# EAGLE design obdNode (EAGLE 6.5.0)
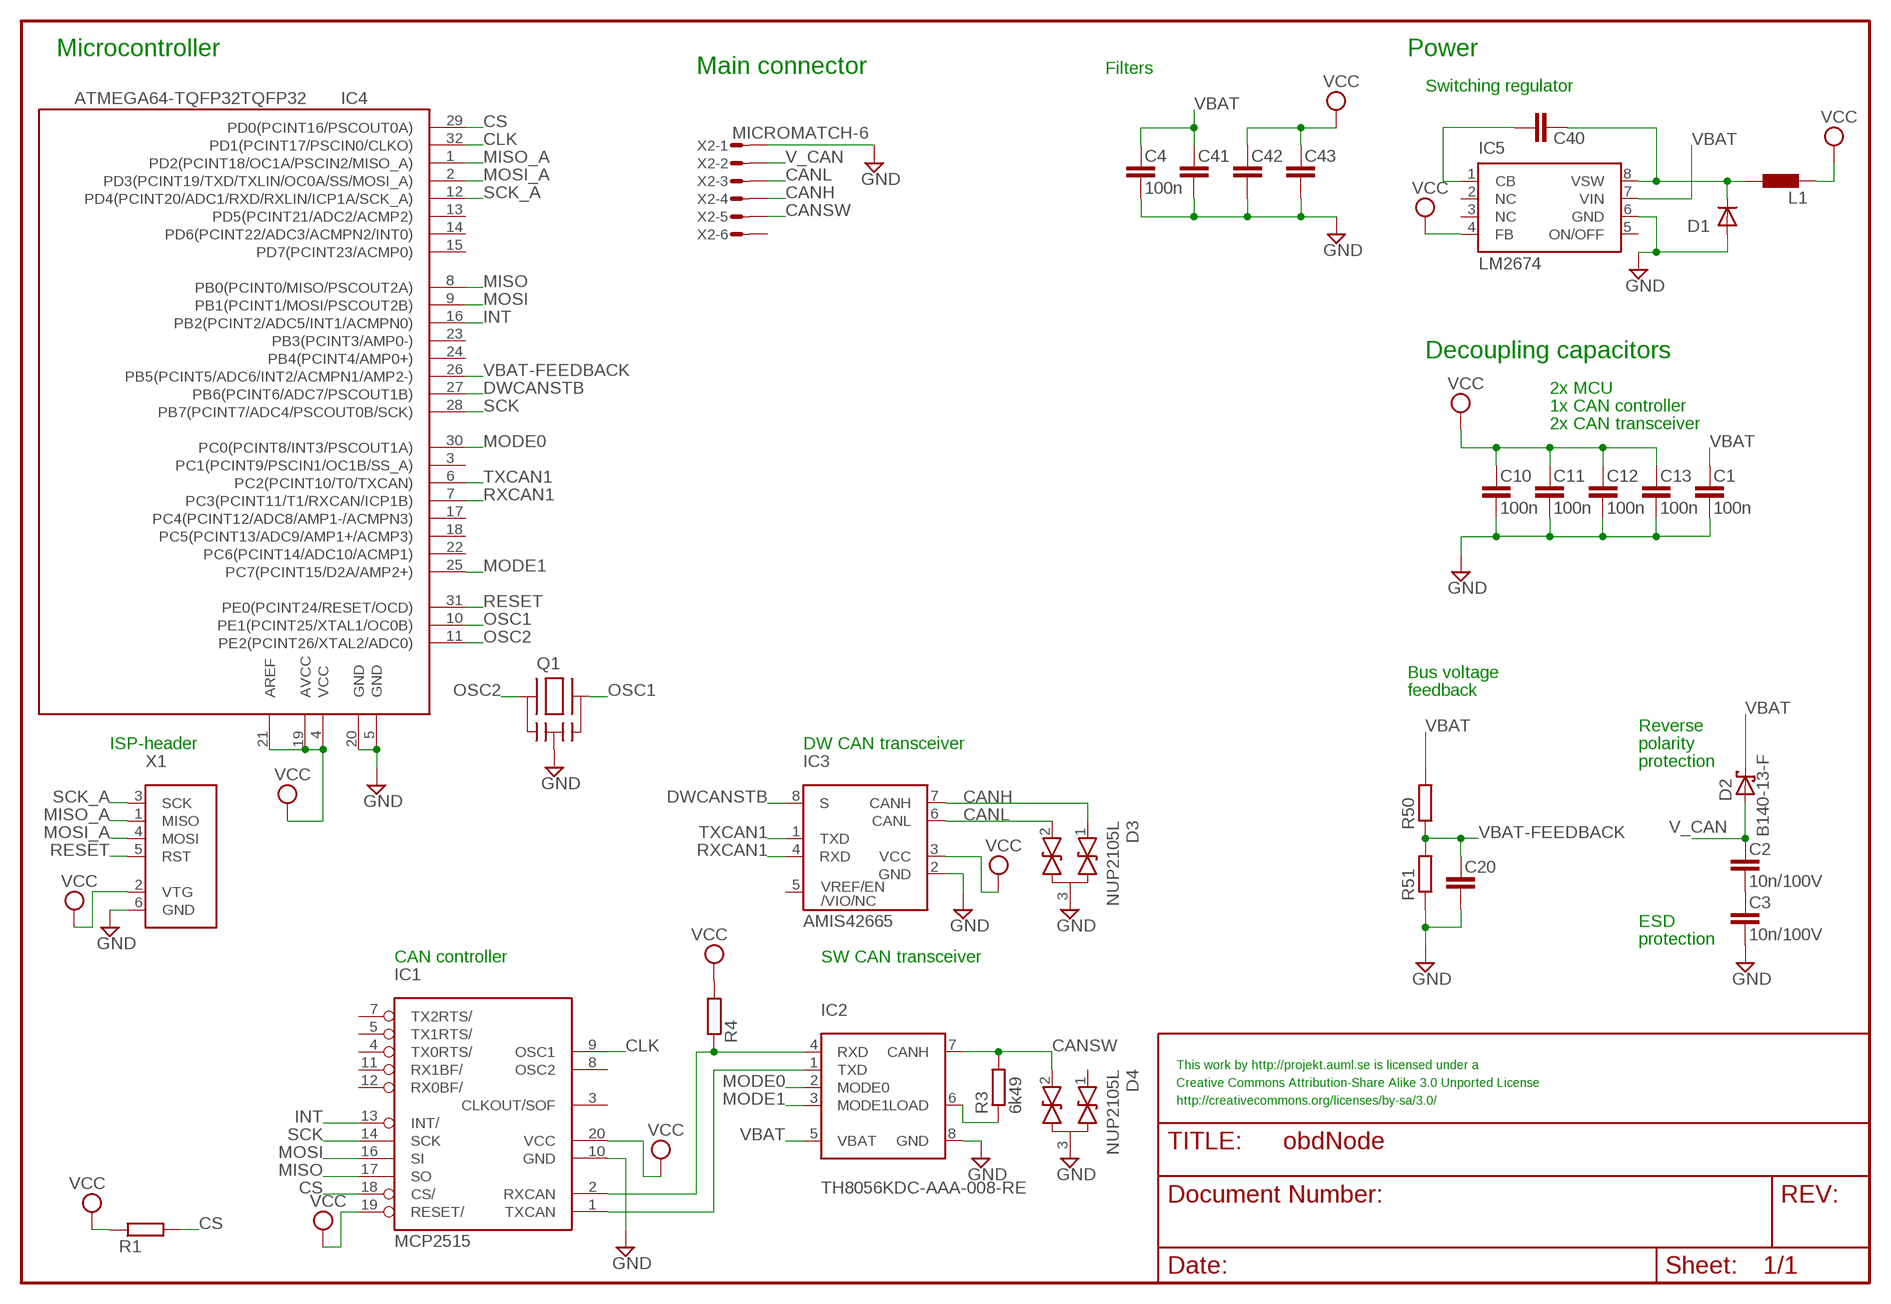
[diagram p0: schematic, sheet 1]

## Parts
C1  100n  C-EUC0402  [C0402]
C2  10n/100V  C-EUC0805  [C0805]
C3  10n/100V  C-EUC0805  [C0805]
C4  100n  C-EUC0402  [C0402]
C10  100n  C-EUC0402  [C0402]
C11  100n  C-EUC0402  [C0402]
C12  100n  C-EUC0402  [C0402]
C13  100n  C-EUC0402  [C0402]
C20  C-EUC0402  [C0402]
C40  C-EUC0603  [C0603]
C41  C-EUC1210  [C1210]
C42  C-EUC1210  [C1210]
C43  C-EUC0402  [C0402]
D1  DIODESMP  [DO-220AA]
D2  B140-13-F  SCHOTTKY-DIODESMA  [SMA]
D3  NUP2105L  DUALTVSSOT23  [SOT23]
D4  NUP2105L  DUALTVSSOT23  [SOT23]
IC1  MCP2515  [TSSOP]
IC2  TH8056KDC-AAA-008-RE  TH8056SOIC  [SOIC]
IC3  AMIS42665  [SOIC]
IC4  ATMEGA64-TQFP32TQFP32  [TQFP32]
IC5  LM2674  [SO8]
L1  L-EUL1210  [L1210]
Q1  CSTCESMD  [SMD]
R1  R-EUR0402  [R0402]
R3  6k49  R-EUR0805  [R0805]
R4  R-EUR0402  [R0402]
R50  R-EUR0402  [R0402]
R51  R-EUR0402  [R0402]
X1  AVRISP6PINHEADER  [6PINHEADER]
X2  MICROMATCH-6  [MICROMATCH-6]

## Nets
CANH: D3.1 IC3.7(CANH) X2.4
CANL: D3.2 IC3.6(CANL) X2.3
CANSW: D4.2 IC2.7(CANH) R3.2 X2.5
CB: C40.1 IC5.1(CB)
CLK: IC1.9(OSC1) IC4.32(PD1(PCINT17/PSCIN0/CLKO))
CS: IC1.18(CS/) IC4.29(PD0(PCINT16/PSCOUT0A)) R1.2
DWCANSTB: IC3.8(S) IC4.27(PB6(PCINT6/ADC7/PSCOUT1B))
GND: C1.2 C3.2 C4.2 C10.2 C11.2 C12.2 C13.2 C20.2 C41.2 C42.2 C43.2 D1.A D3.3 D4.3 IC1.10(GND) IC2.8(GND) IC3.2(GND) IC4.5(GND) IC4.20(GND) IC5.6(GND) Q1.2(GND) R51.1 X1.6(GND) X2.1
INT: IC1.13(INT/) IC4.16(PB2(PCINT2/ADC5/INT1/ACMPN0))
MISO: IC1.17(SO) IC4.8(PB0(PCINT0/MISO/PSCOUT2A))
MISO_A: IC4.1(PD2(PCINT18/OC1A/PSCIN2/MISO_A)) X1.1(MISO)
MODE0: IC2.2(MODE0) IC4.30(PC0(PCINT8/INT3/PSCOUT1A))
MODE1: IC2.3(MODE1) IC4.25(PC7(PCINT15/D2A/AMP2+))
MOSI: IC1.16(SI) IC4.9(PB1(PCINT1/MOSI/PSCOUT2B))
MOSI_A: IC4.2(PD3(PCINT19/TXD/TXLIN/OC0A/SS/MOSI_A)) X1.4(MOSI)
N$1: C2.2 C3.1
N$3: IC2.6(LOAD) R3.1
OSC1: IC4.10(PE1(PCINT25/XTAL1/OC0B)) Q1.3
OSC2: IC4.11(PE2(PCINT26/XTAL2/ADC0)) Q1.1
RESET: IC4.31(PE0(PCINT24/RESET/OCD)) X1.5(RST)
RXCAN1: IC3.4(RXD) IC4.7(PC3(PCINT11/T1/RXCAN/ICP1B))
RXCAN2: IC1.2(RXCAN) IC2.4(RXD) R4.1
SCK: IC1.14(SCK) IC4.28(PB7(PCINT7/ADC4/PSCOUT0B/SCK))
SCK_A: IC4.12(PD4(PCINT20/ADC1/RXD/RXLIN/ICP1A/SCK_A)) X1.3(SCK)
TXCAN1: IC3.1(TXD) IC4.6(PC2(PCINT10/T0/TXCAN))
TXCAN2: IC1.1(TXCAN) IC2.1(TXD)
V_CAN: C2.1 D2.A X2.2
VBAT: C1.1 C4.1 C41.1 D2.C IC2.5(VBAT) IC5.7(VIN) R50.2
VBAT-FEEDBACK: C20.1 IC4.26(PB5(PCINT5/ADC6/INT2/ACMPN1/AMP2-)) R50.1 R51.2
VCC: C10.1 C11.1 C12.1 C13.1 C42.1 C43.1 IC1.19(RESET/) IC1.20(VCC) IC3.3(VCC) IC4.4(VCC) IC4.19(AVCC) IC4.21(AREF) IC5.4(FB) L1.1 R1.1 R4.2 X1.2(VTG)
VSW: C40.2 D1.C IC5.8(VSW) L1.2
Unconnected: D4.1 IC1.3(CLKOUT/SOF) IC1.4(TX0RTS/) IC1.5(TX1RTS/) IC1.7(TX2RTS/) IC1.8(OSC2) IC1.11(RX1BF/) IC1.12(RX0BF/) IC3.5(VREF/EN/VIO/NC) IC4.3(PC1(PCINT9/PSCIN1/OC1B/SS_A)) IC4.13(PD5(PCINT21/ADC2/ACMP2)) IC4.14(PD6(PCINT22/ADC3/ACMPN2/INT0)) IC4.15(PD7(PCINT23/ACMP0)) IC4.17(PC4(PCINT12/ADC8/AMP1-/ACMPN3)) IC4.18(PC5(PCINT13/ADC9/AMP1+/ACMP3)) IC4.22(PC6(PCINT14/ADC10/ACMP1)) IC4.23(PB3(PCINT3/AMP0-)) IC4.24(PB4(PCINT4/AMP0+)) IC5.2(NC) IC5.3(NC) IC5.5(ON/OFF) X2.6

## Notes on the sheet
- Microcontroller | Power
- Main connector | Filters
- Switching regulator
- Decoupling capacitors
- 2x MCU
- 1x CAN controller
- 2x CAN transceiver
- Bus voltage
- feedback
- Reverse
- ISP-header | DW CAN transceiver | polarity
- protection
- ESD
- protection
- CAN controller | SW CAN transceiver
- This work by http://projekt.auml.se is licensed under a
- Creative Commons Attribution-Share Alike 3.0 Unported License
- http://creativecommons.org/licenses/by-sa/3.0/

## Library data of the parts
C1-C4 C10-C13 C20 C40-C43 = rcl:C-EU
D1 = diode:DIODE: DIODE ultra fast rectifier, 3 A
D2 = diode:SCHOTTKY-DIODE
D3 D4 = diode:DUALTVS
IC1 = mcp2515:MCP2515
IC2 = th8056:TH8056
IC3 = amis42665:AMIS42665
IC4 = atmega64:ATMEGA64-TQFP32
IC5 = lm2674:LM2674
L1 = rcl:L-EU
Q1 = xtal_CSTCE:CSTCE
R1 R3 R4 R50 R51 = rcl:R-EU
X1 = avrisp:AVRISP6PIN
X2 = con-amp-micromatch:MICROMATCH-6: MicroMaTch 6 7-215464-6 / 0-215464-6 Drawing Number C-215464 DDEController.pdf

## Board
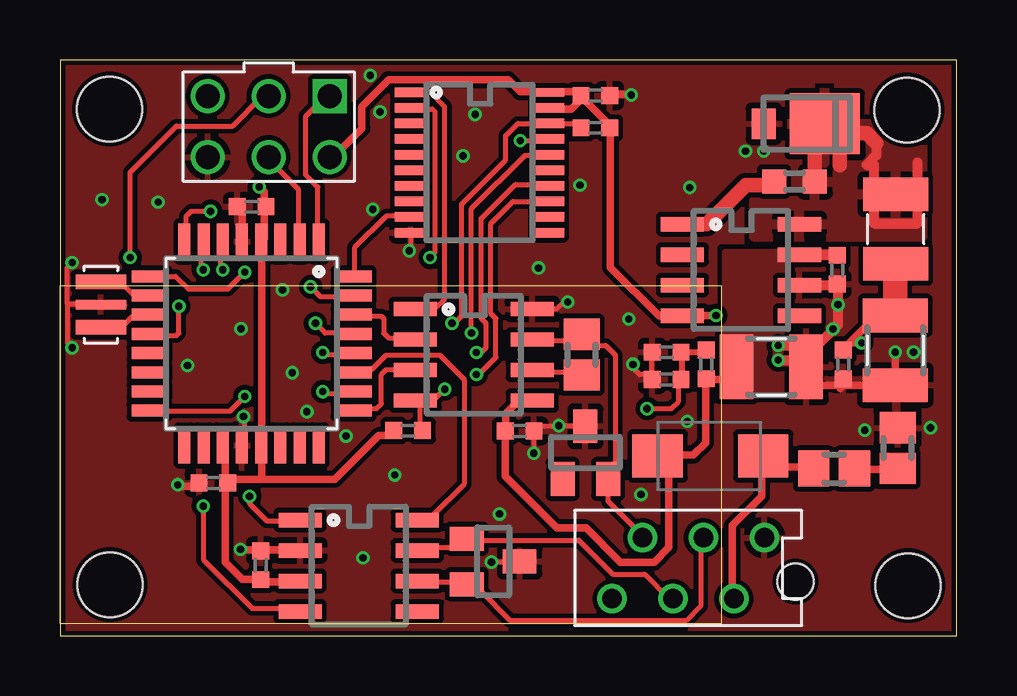
[diagram p1: board, top side]
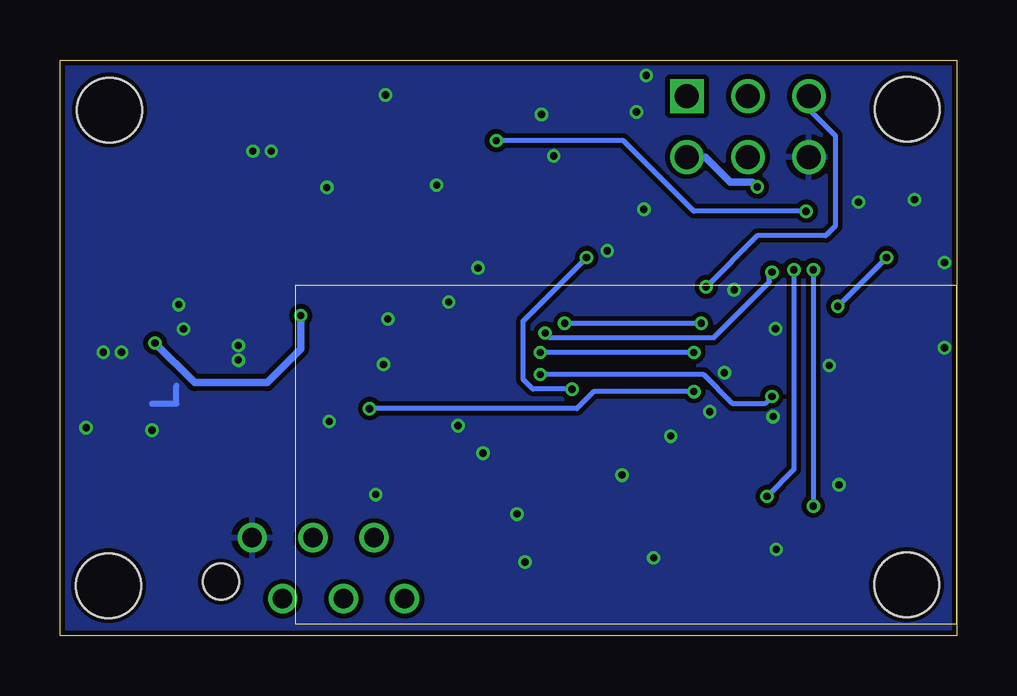
[diagram p2: board, bottom side, seen from below]

Size 37.36 x 24.01 mm. Coordinates in mm from the lower left corner, seen from the top.
Outline: 0,0 37.36,0 37.36,24.01 0,24.01 0,0
Copper layers (1*16): Top 0.035mm / dielectric 1.5mm / Bottom 0.035mm
Design rules "10mils, 0.6drill *": minimum track width 6mil, minimum drill 0.3mm, track to track 6mil, track to pad 6mil, pad to pad 6mil, via to via 6mil, smd to smd 0mil, copper to edge 8mil, drill to drill 10mil, minimum pad ring 8mil, minimum via ring 5mil, stop-mask expansion 0mil, vias tented up to drill 0.7mm, thermal gap 10mil
Holes 2.7 mm at 35.3,21.92 2.06,21.96 35.34,2.09 2.08,2.13
Milling: 4 lines

### Footprints (pad centres in the part's own frame; a part is rotated, then mirrored left to right if it is on the bottom)
C0402 = smd 0.7 x 0.7: 1 -0.6,0; 2 0.6,0
C0805 = smd 1.3 x 1.5: 1 -0.85,0; 2 0.85,0
C0603 = smd 1 x 1: 1 -0.85,0; 2 0.85,0
C1210 = smd 1.4 x 2.7: 1 -1.4,0; 2 1.5,0
DO-220AA = smd 1.016 x 1.27: A 1.143,0 | smd 2.921 x 2.54: C -1.397,0
SMA = smd 2.1 x 1.8: A 2.1,0; C -2.3,0
SOT23 = smd 1 x 1.4: 1 -0.95,-1.1; 2 0.95,-1.1; 3 0,1.1
TSSOP = smd 0.396 x 1.3: 1 -2.925,-2.875; 2 -2.275,-2.875; 3 -1.625,-2.875; 4 -0.975,-2.875; 5 -0.325,-2.875; 6 0.325,-2.875; 7 0.975,-2.875; 8 1.625,-2.875; 9 2.275,-2.875; 10 2.925,-2.875; 11 2.925,2.875; 12 2.275,2.875; 13 1.625,2.875; 14 0.975,2.875; 15 0.325,2.875; 16 -0.325,2.875; 17 -0.975,2.875; 18 -1.625,2.875; 19 -2.275,2.875 | smd 0.369 x 1.3: 20 -2.925,2.875
SOIC = smd 0.6 x 1.8: 1 -1.905,-2.44; 2 -0.635,-2.44; 3 0.635,-2.44; 4 1.905,-2.44; 5 1.905,2.44; 6 0.635,2.44; 7 -0.635,2.44; 8 -1.905,2.44
TQFP32 = smd 1.5 x 0.5: 1 -4.25,2.65; 2 -4.25,1.85; 3 -4.25,1.05; 4 -4.25,0.25; 5 -4.25,-0.55; 6 -4.25,-1.35; 7 -4.25,-2.15; 8 -4.25,-2.95; 17 4.25,-2.95; 18 4.25,-2.15; 19 4.25,-1.35; 20 4.25,-0.55; 21 4.25,0.25; 22 4.25,1.05; 23 4.25,1.85; 24 4.25,2.65 | smd 0.5 x 1.5: 9 -2.8,-4.4; 10 -2,-4.4; 11 -1.2,-4.4; 12 -0.4,-4.4; 13 0.4,-4.4; 14 1.2,-4.4; 15 2,-4.4; 16 2.8,-4.4; 25 2.8,4.1; 26 2,4.1; 27 1.2,4.1; 28 0.4,4.1; 29 -0.4,4.1; 30 -1.2,4.1; 31 -2,4.1; 32 -2.8,4.1
SO8 = smd 0.6 x 1.8: 1 -1.905,-2.44; 2 -0.635,-2.44; 3 0.635,-2.44; 4 1.905,-2.44; 5 1.905,2.44; 6 0.635,2.44; 7 -0.635,2.44; 8 -1.905,2.44
L1210 = smd 1.4 x 2.7: 1 -1.4,0; 2 1.5,0
SMD = smd 0.6 x 2.1: 1 -0.27,0.1; 3 1.63,0.1 | smd 0.4 x 2.1: 2 0.68,0.1
R0402 = smd 0.7 x 0.7: 1 -0.6,0; 2 0.6,0
R0805 = smd 1.3 x 1.5: 1 -0.85,0; 2 0.85,0
6PINHEADER = drill 1 square: 1 -1.27,2.54 | drill 1: 2 1.27,2.54; 3 -1.27,0; 4 1.27,0; 5 -1.27,-2.54; 6 1.27,-2.54
MICROMATCH-6 = drill 0.813: 1 3.175,1.27; 2 1.905,-1.27; 3 0.635,1.27; 4 -0.635,-1.27; 5 -1.905,1.27; 6 -3.175,-1.27 | hole 1.5: 4.469,-0.562

### Placement (x,y rotation side)
C1  19.15,8.55 0 top
C2  32.26,6.97 0 top
C3  34.9,7.83 90 top
C4  32.38,15.27 270 top
C10  6.39,6.37 180 top
C11  8.36,2.95 90 top
C12  22.31,22.53 0 top
C13  7.99,17.89 180 top
C20  25.27,11.83 180 top
C40  30.61,18.94 0 top
C41  29.59,11.22 0 top
C42  34.8,11.96 270 top
C43  32.64,11.32 270 top
D1  30.47,21.35 180 top
D2  27.2,7.5 0 top
D3  18.05,3.1 270 top
D4  21.89,7.64 0 top
IC1  17.48,19.74 270 top
IC2  17.24,11.72 270 top
IC3  12.45,2.92 270 top
IC4  8.13,12.19 270 top
IC5  28.37,15.26 270 top
L1  34.82,16.91 90 top
Q1  1.8,13.13 90 top
R1  22.31,21.18 180 top
R3  21.74,11.72 90 top
R4  14.5,8.56 180 top
R50  26.92,11.32 270 top
R51  25.27,10.69 0 top
X1  8.7,21.24 270 top
X2  26.18,2.82 0 top

### Tracks (layer width: path | path; a pad name or v marks a point on that pad's centre or on a via)
CANH
  Top 0.203: IC3.7 14.89,3.68 16.43,3.68 16.43,4.05 D3.1 17.38,4.05 17.45,3.99 21.61,3.99 23.04,2.56 24.36,2.56 25.37,1.55 X2.4
CANL
  Top 0.203: IC3.6 14.89,2.26 16.43,2.26 16.43,2.15 D3.2 17.35,2.15 17.55,1.96 17.55,1.85 18.77,0.63 26.09,0.63 26.7,1.24 26.7,3.89 26.9,4.09 X2.3
CANSW
  Top 0.203: IC2.7 20.19,12.36 20.19,12.32 21.74,12.32 | 21.74,12.32 R3.2 | X2.5 24.25,4.09 24.16,4.19 24.16,4.29 22.84,5.61 22.84,6.54 D4.2 22.84,6.94 23.14,7.24 23.14,11.71 22.73,12.12 22.43,12.12 22.33,12.22 21.84,12.22 21.74,12.32
CB
  Top 0.152: C40.1 29.72,18.94 29.59,18.81
  Top 0.406: IC5.1 26.42,17.16
  Top 0.61: C40.1 29.72,18.9 | 29.59,18.81 29.74,18.92 29.74,18.79 28.58,18.79 26.95,17.16 IC5.1
CLK
  Top 0.203: 12.78,15.06 12.3,15.06 IC4.32 12.27,15.03 12.27,16.18 13.59,17.5 14.1,17.5 14.54,17.4 IC1.9
CS  (via drill 0.3)
  Top 0.203: IC1.18 | IC1.18 21.68,21.36 R1.2 | IC4.29 11.79,12.59 11.76,12.62 11.05,12.62 v10.64,13.03 | v16.33,13.03 16.43,13.03 16.74,13.33 16.74,18.01 18.57,19.84 18.57,20.85 19.07,21.36 IC1.18
  Bottom 0.203: v10.64,13.03 v16.33,13.03
DWCANSTB
  Top 0.203: IC4.27 12.34,11.1 12.98,11.1 13.59,11.71 15.82,11.71 16.84,10.69 16.84,6.32 15.52,5 15.06,5 IC3.8
GND  (via drill 0.3)
  Top 0.203: IC4.20 7.58,8.44 7.7,8.56 7.7,9.09 v7.64,9.14 | C10.2 5.71,6.37 5.56,6.22 | 8.31,3.58 8.34,3.54 C11.2 8.4,3.58 | 7.54,3.58 v7.52,3.61 | Q1.2 0.82,13.81 0.79,13.84 0.31,13.84 | 0.31,13.84 0.31,12.21 v0.5,12.01 | 0.31,13.84 0.31,15.37 v0.5,15.57 | C12.2 23.09,22.53 23.14,22.58 | R51.1 24.67,10.79 24.66,10.79 | 24.66,10.79 24.66,11.82 C20.2 | 24.66,10.79 24.56,10.9 24.16,10.9 23.88,11.18 v23.88,11.32 | D4.3 21.77,8.86 21.51,8.86 21.41,8.76 v20.78,8.76 19.96,8.76 C1.2 19.68,8.48 19.68,8.46 19.74,8.41 v19.74,7.62 | D3.3 19.12,3.07 v17.98,3.07 | IC4.5 7.6,16.46 | IC1.10 14.61,16.28 14.4,16.08 14.58,16.08 v14.55,16.05 | IC2.8 19.77,13.63 19.79,13.64 20.7,13.64 20.98,13.92 v21.16,13.92 | 9.42,3.58 9.45,3.56 IC3.2 | 7.6,17.68 C13.2
  Top 0.305: 32.77,10.43 32.73,10.47 C43.2 32.64,10.43 | 32.77,10.43 34.8,10.43 C42.2 v34.8,11.83 | C41.2 31.09,10.84 31.5,10.43 32.64,10.43 | 32.64,10.43 32.77,10.43 | 32.64,10.43 32.51,10.3 | 5.56,6.22 4.98,6.22 v4.9,6.3 | 8.31,3.58 7.54,3.58 | 23.14,22.58 23.77,22.58 v23.8,22.55 | 7.6,16.46 7.6,17.68 | 8.4,3.58 9.42,3.58
  Top 0.406: IC5.6 32.34,14.62 C4.2 32.41,14.64 32.41,12.96 31.17,11.71 | 29.95,12.12 31.06,12.12 | 29.95,11.51 31.06,11.51
  Bottom 0.254: 32.51,10.43 32.51,9.67 33.53,9.67
  other vias: 29.93,12.11 29.32,20.21 32.42,13.81 28.56,20.21 35.56,11.83 13.03,17.78 4.09,18.08 1.75,18.19 13.34,21.84 17.3,21.74 19.94,15.34 21.67,18.8 26.24,18.69 23.7,13.21 26.14,8.94 24.21,5.89 18.31,5.08 12.62,3.25 13.94,6.71 9.68,10.97 5.31,11.28 33.53,8.58 36.27,8.68 16.79,20.02 12.93,23.37 11.91,8.33 10.29,9.35 9.27,14.43 7.54,12.8 29.93,11.5 32.21,12.79
  pour Bottom (isolate 0.203, rank 3): 37.36,24 37.36,0.01 0,0.01 0,24
  pour Top (isolate 0.203, rank 3): 37.36,24 37.36,0.01 0,0.01 0,24
INT  (via drill 0.3)
  Top 0.203: IC4.16 4.22,9.39 4.24,9.37 7.09,9.37 v7.7,9.98 | v17.35,10.9 17.45,10.9 18.16,11.61 18.16,13.23 17.96,13.44 17.96,17.2 18.87,18.11 IC1.13
  Bottom 0.203: v7.7,9.98 8,9.68 9.32,9.68 10.54,10.9 v17.35,10.9
MISO  (via drill 0.3)
  Top 0.203: IC4.8 5.18,16.91 5.26,16.99 5.26,17.5 5.46,17.7 v6.27,17.7 | v19.18,20.65 19.89,20.65 19.99,20.75 20.32,20.75 IC1.17
  Bottom 0.203: v6.27,17.7 10.95,17.7 13.89,20.65 v19.18,20.65
MISO_A
  Top 0.203: IC4.1 10.78,16.55 10.74,16.59 10.74,18.72 10.24,19.23 10.24,21.67 10.74,22.17 10.9,22.17 X1.1
MODE0
  Top 0.203: IC4.30 12.82,13.39 12.88,13.33 13.39,13.33 13.49,13.23 13.49,12.62 13.69,12.42 14.74,12.42 IC2.2
MODE1
  Top 0.203: IC4.25 12.79,9.39 12.88,9.47 13.18,9.47 13.39,9.68 13.39,10.9 13.59,11.1 14.79,11.1 IC2.3
MOSI  (via drill 0.3)
  Top 0.203: IC4.9 4.82,14.99 5.36,14.45 6.98,14.45 v7.7,15.16 | v17.14,12.62 17.14,17.8 19.38,20.04 20.33,20.04 IC1.16
  Bottom 0.203: v7.7,15.16 7.8,15.06 7.8,14.76 10.13,12.42 16.94,12.42 v17.14,12.62
MOSI_A
  Top 0.203: X1.4 8.79,19.97 8.81,19.94 8.81,19.74 9.93,18.62 9.93,16.49 IC4.2
N$1
  Top 0.203: C2.2 33.36,6.97 33.5,6.93 | 34.75,6.93 C3.1
  Top 0.305: 33.5,6.93 34.75,6.93
N$3
  Top 0.203: IC2.6 20.3,11.09 20.3,11 21.74,11 R3.1
OSC1
  Top 0.203: Q1.3 2.51,14.76 3.02,14.25 3.67,14.25 IC4.10
OSC2
  Top 0.203: Q1.1 2.55,12.86 3.02,13.33 3.67,13.33 IC4.11
RESET  (via drill 0.3)
  Top 0.203: v10.44,14.55 10.85,14.15 12.19,14.15 IC4.31
  Bottom 0.203: X1.5 6.15,21.95 5.05,20.85 5.05,17.09 5.46,16.69 8.31,16.69 v10.44,14.55
RXCAN1  (via drill 0.3)
  Top 0.203: IC4.7 5.98,15.99 5.87,15.87 5.87,15.37 v5.97,15.26 | v5.97,5.41 5.97,3.17 8,1.14 9.88,1.14 IC3.4
  Bottom 0.203: v5.97,15.26 v5.97,5.41
RXCAN2  (via drill 0.3)
  Top 0.203: R4.1 15.01,8.56 15.01,9.82 | 15.01,9.82 IC2.4 | 15.01,9.82 15.38,9.92 15.62,9.88 v16.03,10.29 | IC1.2 14.97,22.01 15.01,21.97 15.52,21.97 15.62,21.87 15.62,15.98 v15.42,15.77
  Bottom 0.203: v16.03,10.29 17.65,10.29 18.06,10.69 18.06,13.13 v15.42,15.77
SCK  (via drill 0.3)
  Top 0.203: IC4.28 11.74,11.79 11.66,11.71 11.05,11.71 v10.95,11.81 | v17.35,11.81 17.55,11.81 17.75,12.01 17.75,13.03 17.55,13.23 17.55,17.4 18.97,18.82 20.3,18.82 IC1.14
  Bottom 0.203: v10.95,11.81 v17.35,11.81
SCK_A  (via drill 0.3)
  Top 0.203: IC4.12 4.17,12.59 4.24,12.52 4.85,12.52 4.95,12.62 v4.95,13.74 | v2.92,15.77 2.92,19.33 4.85,21.26 7.19,21.26 8.43,22.51 X1.3 8.71,22.52
  Bottom 0.203: v4.95,13.74 v2.92,15.77
TXCAN1  (via drill 0.3)
  Top 0.203: IC4.6 6.78,15.97 6.68,15.87 6.68,15.37 v6.78,15.26 | v7.9,5.82 7.9,5.51 8.61,4.8 9.98,4.8 IC3.1
  Bottom 0.203: v6.78,15.26 6.78,6.93 v7.9,5.82
TXCAN2
  Top 0.203: IC2.1 15.4,13.63 15.52,13.74 15.62,13.64 16.03,14.05 16.03,22.07 15.42,22.68 14.63,22.68 IC1.1
V_CAN
  Top 0.203: 28.08,1.58 28.02,1.65 | 29.23,7.44 D2.A 29.3,7.38 29.64,7.04 | 31.34,7.04 C2.1
  Top 0.305: X2.2 28.08,1.58 | 28.02,1.65 28.02,4.6 29.23,5.82 29.23,7.44 | 29.64,7.04 31.34,7.04
VBAT
  Top 0.203: C1.1 18.77,8.55 | 19.18,9.68 19.68,9.68 IC2.5 | 25.78,7.54 25.74,7.5 D2.C 25.27,7.13 25.27,6.83 25.38,6.73 | 26.9,10.7 R50.2 26.92,10.69
  Top 0.254: C41.1 28.19,11.19 27.69,10.69
  Top 0.305: 27.69,10.69 26.92,10.69 | 25.78,7.54 26.39,7.54 26.9,8.05 26.9,10.7 | 25.38,6.73 25.38,3.68 24.77,3.07 23.34,3.07 21.92,4.5 20.7,4.5 18.55,6.65 C1.1 18.57,8.56 18.57,9.27 18.97,9.68 19.18,9.68
  Top 0.406: IC5.7 32.36,15.89 C4.1
  pour Top (isolate 0.203, no thermals): 27.69,16.02 27.69,10.05 30.35,10.05 30.35,15.77 32.38,15.77 32.38,16.02
VBAT-FEEDBACK  (via drill 0.3)
  Top 0.152: C20.1 25.91,12.08
  Top 0.203: C20.1 25.87,11.99 | IC4.26 11.77,10.19 11.66,10.08 11.05,10.08 v10.95,10.18 | v24.46,9.47 25.48,9.47 25.78,9.78 25.78,10.59 R51.2
  Top 0.254: R50.1 26.89,11.92 26.8,11.83 25.91,11.83 | R51.2 26,10.78 25.91,10.81 25.91,11.83 | C20.1 25.91,11.83
  Bottom 0.203: v10.95,10.18 15.11,10.18 15.82,9.47 v24.46,9.47
VCC  (via drill 0.3)
  Top 0.203: C11.1 8.36,2.26 | 9.32,2.26 9.32,2.29 IC3.3 | 8.51,17.6 8.59,17.68 C13.1 8.59,18.03 8.51,18.11 | 8.51,16.57 IC4.4 8.38,16.21 8.41,16.18 | IC4.19 6.78,7.55 6.88,7.44 | 6.88,6.48 C10.1 | C10.1 7.03,6.37 7.19,6.53 | 8.41,7.91 IC4.21 | IC1.19 20.74,22.01 20.8,21.97 | 20.38,22.68 IC1.20 20.33,22.68 | 21.55,22.68 C12.1 21.71,22.37 21.93,22.27 | 22.81,21.39 R1.1 | R4.2 13.9,8.47 13.79,8.36 | 8.36,2.44 8.18,2.44 8.1,2.36 | 6.88,6.26 C10.1 | 22.94,21.39 22.94,21.37 22.94,21.36 | 26.62,13.33 IC5.4
  Top 0.254: 32.77,12.08 32.55,12.04 | 32.55,12.04 C43.1 | 33.66,12.97 C42.1 | 32.89,12.21 32.77,12.08 | 32.55,12.04 32.73,12.04 32.77,12.08 | C11.1 8.36,2.44 | R1.1 22.94,21.39
  Top 0.305: 33.66,12.97 32.89,12.21 v33.4,12.21 | IC5.4 v27.33,13.35 | 8.36,2.26 9.32,2.26 | 8.51,17.6 8.51,16.57 | 6.88,7.44 6.88,6.48 | 7.19,6.53 8.41,6.53 | 8.41,6.53 8.41,7.91 8.41,16.18 | 20.8,21.97 21.31,21.97 21.71,22.37 | 20.38,22.68 21.55,22.68 | 21.93,22.27 22.81,21.39 | 13.79,8.36 13.28,8.36 11.46,6.53 8.41,6.53 | 8.1,2.36 7.6,2.36 6.88,3.07 6.88,6.26 | 8.51,18.11 8.51,18.52 v8.31,18.72 | X1.2 11.38,19.97 12.57,21.16 12.57,22.07 13.69,23.19 18.67,23.19 19.18,22.68 20.33,22.68 | 22.94,21.36 22.94,15.37 24.97,13.33 26.62,13.33
  Top 1.016: L1.1 34.8,15.12 C42.1 34.67,13.48
  Bottom 0.305: v33.4,12.21 31.75,10.56 28.73,10.56 27.33,11.96 v27.33,13.35 | v8.31,18.72 8.51,18.92 9.42,18.92 10.47,19.97 X1.2
VSW
  Top 0.305: D1.C 32.12,21.08
  Top 0.406: 34.01,20.55 34.01,20.04 33.6,19.63 33.91,19.63 33.91,17.2 35.74,17.2 35.74,19.74
  Top 0.61: C40.2 31.46,20.74 31.47,20.75 32.18,20.75 32.49,20.45 32.49,19.63 | D1.C 32.6,21.35 32.99,20.96 33.6,20.96 34.01,20.55
  pour Top (isolate 0.203): 30.49,22.62 30.49,19.45 28.91,19.45 28.91,16.65 35.94,16.65 35.94,22.62

### Text on the board
Top: Copper, top side
Bottom: Copper, bottom side
Dimension: Dimension
tPlace: Silcscreen, top side
tStop: auml.se | eSID2 | v1 | Soldermask, top side
bStop: Soldermask, bottom side
tCream: Pastemask, top side
bCream: Pastemask, bottom side
Milling: Cut border
Document: Creative Commons Attribution-Share Alike 3.0 Unported License | This work by http://projekt.auml.se is licensed under a | http://creativecommons.org/licenses/by-sa/3.0/
Reference: Component layout